# Altium schematic sheet Connectors.SchDoc: Gimbal Connecters Schematic
size Letter; DrawnBy: Jing Hao Yao & Aidan Gratton; Organization: UW Robotics; Address1: 200 University Avenue; Address2: Waterloo; Address3: Ontario; Address4: Canada N2L 3G6; SheetNumber: 5; SheetTotal: 5
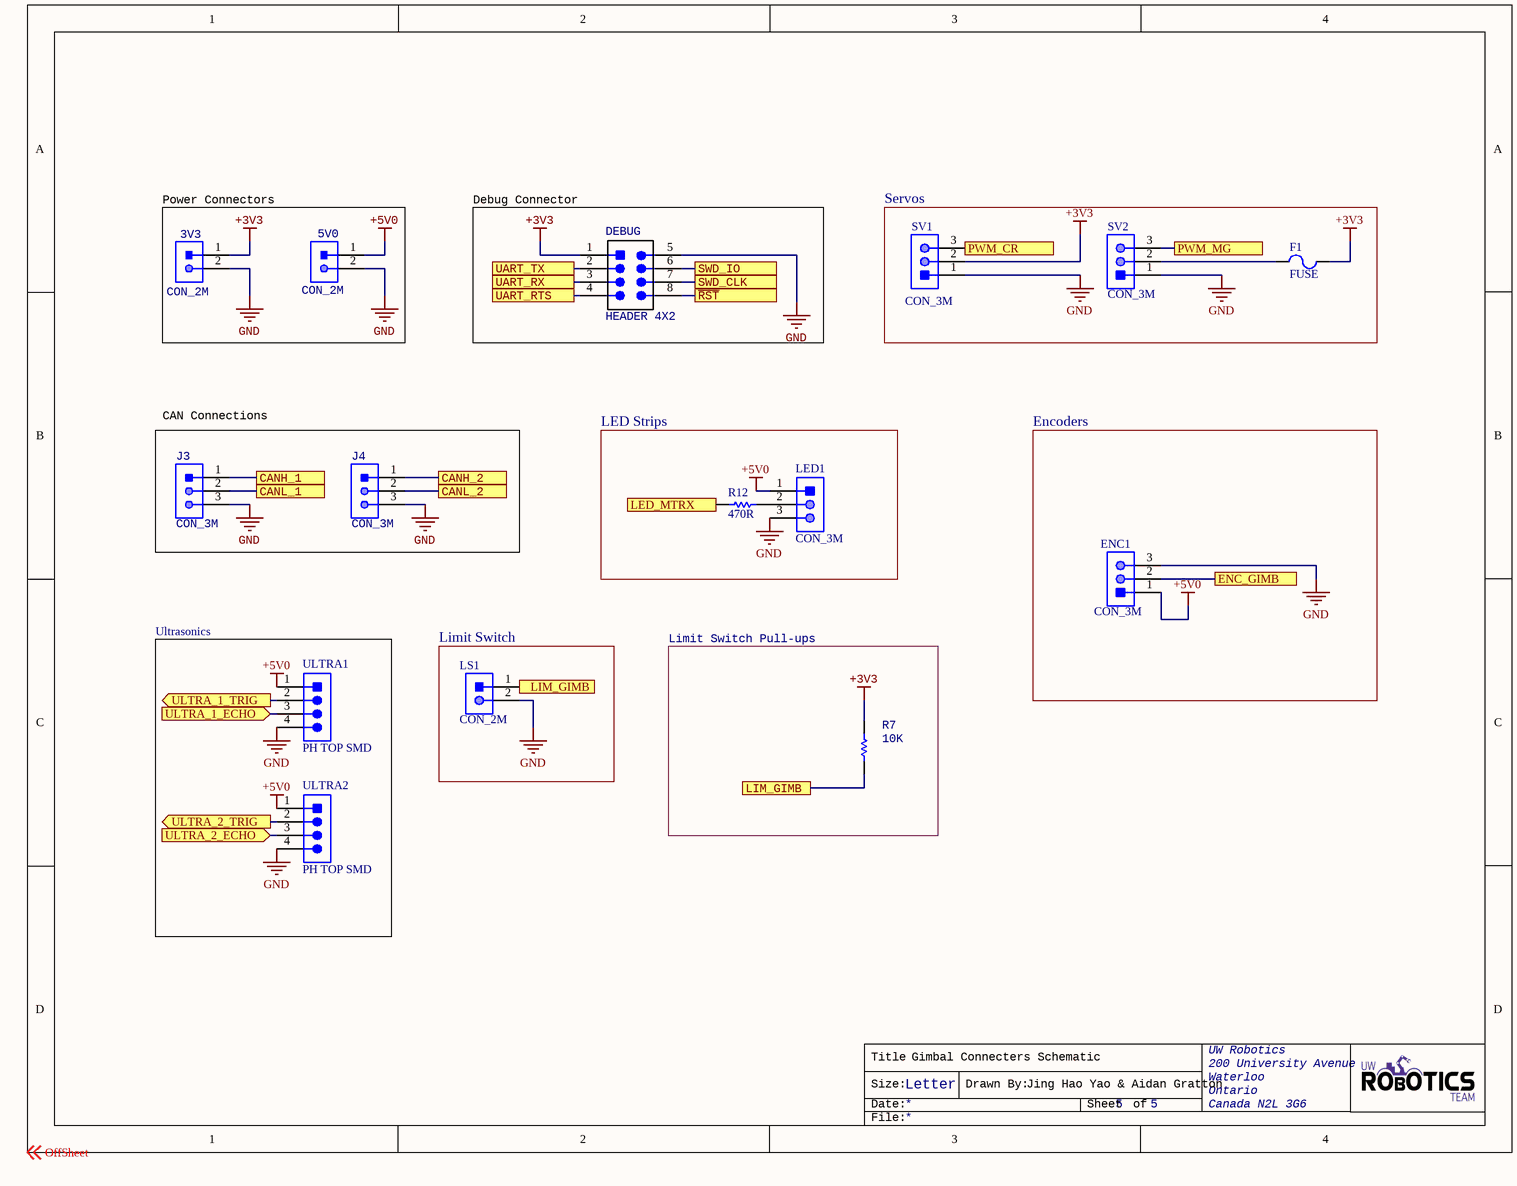
[diagram p0: Connectors.SchDoc]

## Parts
3V3  CON_2M  [JST-B2B-PHSK]
5V0  CON_2M  [JST-B2B-PHSK]
DEBUG  HEADER 4X2  [HEADER_2X4]
ENC1  CON_3M  [JST-B3B-SM4-TB]
F1  FUSE  [FUSE]
J3  CON_3M  [JST-B3B-SM4-TB]
J4  CON_3M  [JST-B3B-SM4-TB]
LED1  CON_3M  [JST-B3B-SM4-TB]
LS1  CON_2M  [JST-B2B-SM4-TB]
R7  value 10K  [RESC0603(1608)_N]  (hidden comment: RES_10K_0603)
R12  value 470R  [RESC0603(1608)_N]  (hidden comment: 470R 1%)
SV1  CON_3M  [JST-B3B-SM4-TB]
SV2  CON_3M  [JST B03B-PASK]
ULTRA1  PH TOP SMD  [JST-B4B-SM4-TB]
ULTRA2  PH TOP SMD  [JST-B4B-SM4-TB]

## Blocks framed on the sheet
Power Connectors: 3V3 5V0
Debug Connector: DEBUG
Servos: F1 SV1 SV2
CAN Connections: J3 J4
LED Strips: LED1 R12
Encoders: ENC1
Ultrasonics: ULTRA1 ULTRA2
Limit Switch: LS1
Limit Switch Pull-ups: R7

## Ports
CANH_1, CANH_2, CANL_1, CANL_2, ENC_GIMB, LED_MTRX, LIM_GIMB, PWM_CR, PWM_MG, SWD_CLK, SWD_IO, UART_RTS, UART_RX, UART_TX, ULTRA_1_ECHO (in), ULTRA_1_TRIG (out), ULTRA_2_ECHO (in), ULTRA_2_TRIG (out), ~{RST}

## Nets
+3V3: 3V3.1 DEBUG.1(VCC) F1.2 R7.2 SV1.2
+5V0: 5V0.1 ENC1.1 LED1.1 ULTRA1.1 ULTRA2.1
GND: 3V3.2 5V0.2 DEBUG.5(GND) ENC1.3 J3.3 J4.3 LED1.3 LS1.2 SV1.1 SV2.1 ULTRA1.4 ULTRA2.4
~{RST}: DEBUG.8 ; port ~{RST}
CANH_1: J3.1 ; port CANH_1
CANH_2: J4.1 ; port CANH_2
CANL_1: J3.2 ; port CANL_1
CANL_2: J4.2 ; port CANL_2
ENC_GIMB: ENC1.2 ; port ENC_GIMB
LED_MTRX: R12.1 ; port LED_MTRX
LIM_GIMB: LS1.1 R7.1 ; port LIM_GIMB
PWM_CR: SV1.3 ; port PWM_CR
PWM_MG: SV2.3 ; port PWM_MG
SWD_CLK: DEBUG.7 ; port SWD_CLK
SWD_IO: DEBUG.6 ; port SWD_IO
UART_RTS: DEBUG.4 ; port UART_RTS
UART_RX: DEBUG.3 ; port UART_RX
UART_TX: DEBUG.2 ; port UART_TX
ULTRA_1_ECHO: ULTRA1.3 ; port ULTRA_1_ECHO
ULTRA_1_TRIG: ULTRA1.2 ; port ULTRA_1_TRIG
ULTRA_2_ECHO: ULTRA2.3 ; port ULTRA_2_ECHO
ULTRA_2_TRIG: ULTRA2.2 ; port ULTRA_2_TRIG
NetF1_1: F1.1 SV2.2
NetLED1_2: LED1.2 R12.2

## Notes on the sheet
- Labels drawn without touching a wire or pin: OffSheet
- Title
- Size:
- Date:
- Letter
- Drawn By:
- Sheet
- of
- File:

## Library data of the parts
DEBUG = HEADER 4X2: Header, 4-Pin Dual row; MPN: GRPB042VWVN-RC; Manufacturer: Sullins Connector Solutions; Digikey Part Number: S9015E-04-ND
F1 = FUSE-5A: FUSE HOLDER RADIAL 250V 6.3A PCB
R7 = RES_10K_0603: RES SMD 10K OHM 5% 1/10W 0603; Manufacturer: Yageo; MPN: RC0603JR-0710KL; Package: 0603 (1608 Metric); Dimensions: 0.063" L x 0.031" W (1.60mm x 0.80mm); Tolerance: 5%; Digikey Part Number: 311-10KGRCT-ND
R12 = RES_470R_0603: RES SMD 470 OHM 1% 1/10W 0603; Manufacturer: Yageo; MPN: AC0603FR-07470RL; Package: 0603 (1608 Metric); Dimensions: 0.063" L x 0.031" W (1.60mm x 0.80mm); Tolerance: 1%; Digikey Part Number: 311-470LDCT-ND
ULTRA1 ULTRA2 = CON_4M_PH_TOP_SMT: CONN HEADER PH TOP 4POS 2MM SMD; Manufacturer: JST; Part Number: B4B-PH-SM4-TB; ComponentLink1Description: Datasheet; ComponentLink1URL: http://www.jst-mfg.com/product/pdf/eng/ePH.pdf